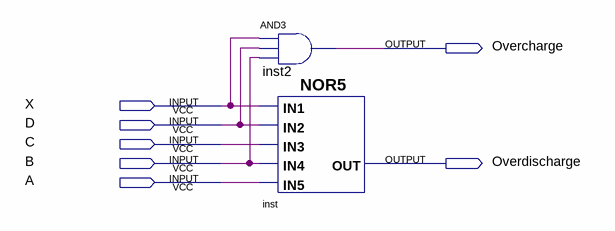
[diagram p0: schematic sheet]
// Quartus schematic AbnormalChargeDischargeDetector.bdf as structural Verilog: 2 symbols, 7 pins
module AbnormalChargeDischargeDetector (
  input  X,
  input  D,
  input  C,
  input  B,
  input  A,
  output Overcharge,
  output Overdischarge
);

  and inst2 (Overcharge, X, D, B);
  nor inst (Overdischarge, X, D, C, B, A);
endmodule
